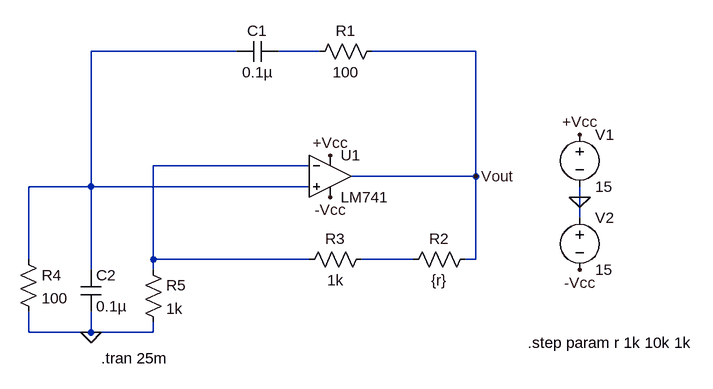
[diagram p0: schematic Wein Bridge.asc]
Wein Bridge.asc, the LTspice schematic file:
Version 4
SHEET 1 880 680
WIRE -96 -80 -320 -80
WIRE 32 -80 -32 -80
WIRE 272 -80 112 -80
WIRE 16 96 -224 96
WIRE 272 112 272 -80
WIRE 272 112 80 112
WIRE -320 128 -320 -80
WIRE -320 128 -416 128
WIRE 16 128 -320 128
WIRE 432 144 432 128
WIRE 432 176 432 144
WIRE -416 240 -416 128
WIRE -224 240 -224 96
WIRE 16 240 -224 240
WIRE 176 240 96 240
WIRE 272 240 272 112
WIRE 272 240 256 240
WIRE -320 256 -320 128
WIRE -224 256 -224 240
WIRE -416 352 -416 320
WIRE -320 352 -320 320
WIRE -320 352 -416 352
WIRE -224 352 -224 336
WIRE -224 352 -320 352
FLAG 432 144 0
FLAG 432 48 +Vcc
FLAG 432 256 -Vcc
FLAG 48 80 +Vcc
FLAG 48 144 -Vcc
FLAG 272 112 Vout
FLAG -320 352 0
SYMBOL voltage 432 32 R0
WINDOW 123 0 0 Left 0
WINDOW 39 0 0 Left 0
SYMATTR InstName V1
SYMATTR Value 15
SYMBOL voltage 432 160 R0
WINDOW 123 0 0 Left 0
WINDOW 39 0 0 Left 0
SYMATTR InstName V2
SYMATTR Value 15
SYMBOL OpAmps\\LM741 48 48 R0
SYMATTR InstName U1
SYMBOL cap -32 -96 R90
WINDOW 0 0 32 VBottom 2
WINDOW 3 32 32 VTop 2
SYMATTR InstName C1
SYMATTR Value 0.1µ
SYMBOL cap -336 256 R0
SYMATTR InstName C2
SYMATTR Value 0.1µ
SYMBOL res 128 -96 R90
WINDOW 0 0 56 VBottom 2
WINDOW 3 32 56 VTop 2
SYMATTR InstName R1
SYMATTR Value 100
SYMBOL res 272 224 R90
WINDOW 0 0 56 VBottom 2
WINDOW 3 32 56 VTop 2
SYMATTR InstName R2
SYMATTR Value {r}
SYMBOL res 112 224 R90
WINDOW 0 0 56 VBottom 2
WINDOW 3 32 56 VTop 2
SYMATTR InstName R3
SYMATTR Value 1k
SYMBOL res -432 224 R0
SYMATTR InstName R4
SYMATTR Value 100
SYMBOL res -240 240 R0
SYMATTR InstName R5
SYMATTR Value 1k
TEXT 352 368 Left 2 !.step param r 1k 10k 1k
TEXT -304 392 Left 2 !.tran 25m

The netlist it stands for:
* Wein Bridge.asc
V1 +Vcc 0 15
V2 0 -Vcc 15
XU1 N001 N003 +Vcc -Vcc Vout LM741  ; pins In+ In- V+ V- OUT
C1 N002 N001 0.1µ
C2 N001 0 0.1µ
R1 Vout N002 100
R2 Vout N004 {r}
R3 N004 N003 1k
R4 N001 0 100
R5 N003 0 1k
.step param r 1k 10k 1k
.tran 25m
.lib LM741.lib
.backanno
.end